# Altium schematic sheet MAIN_CONN.SchDoc
size A; SheetNumber: 5; SheetTotal: 30
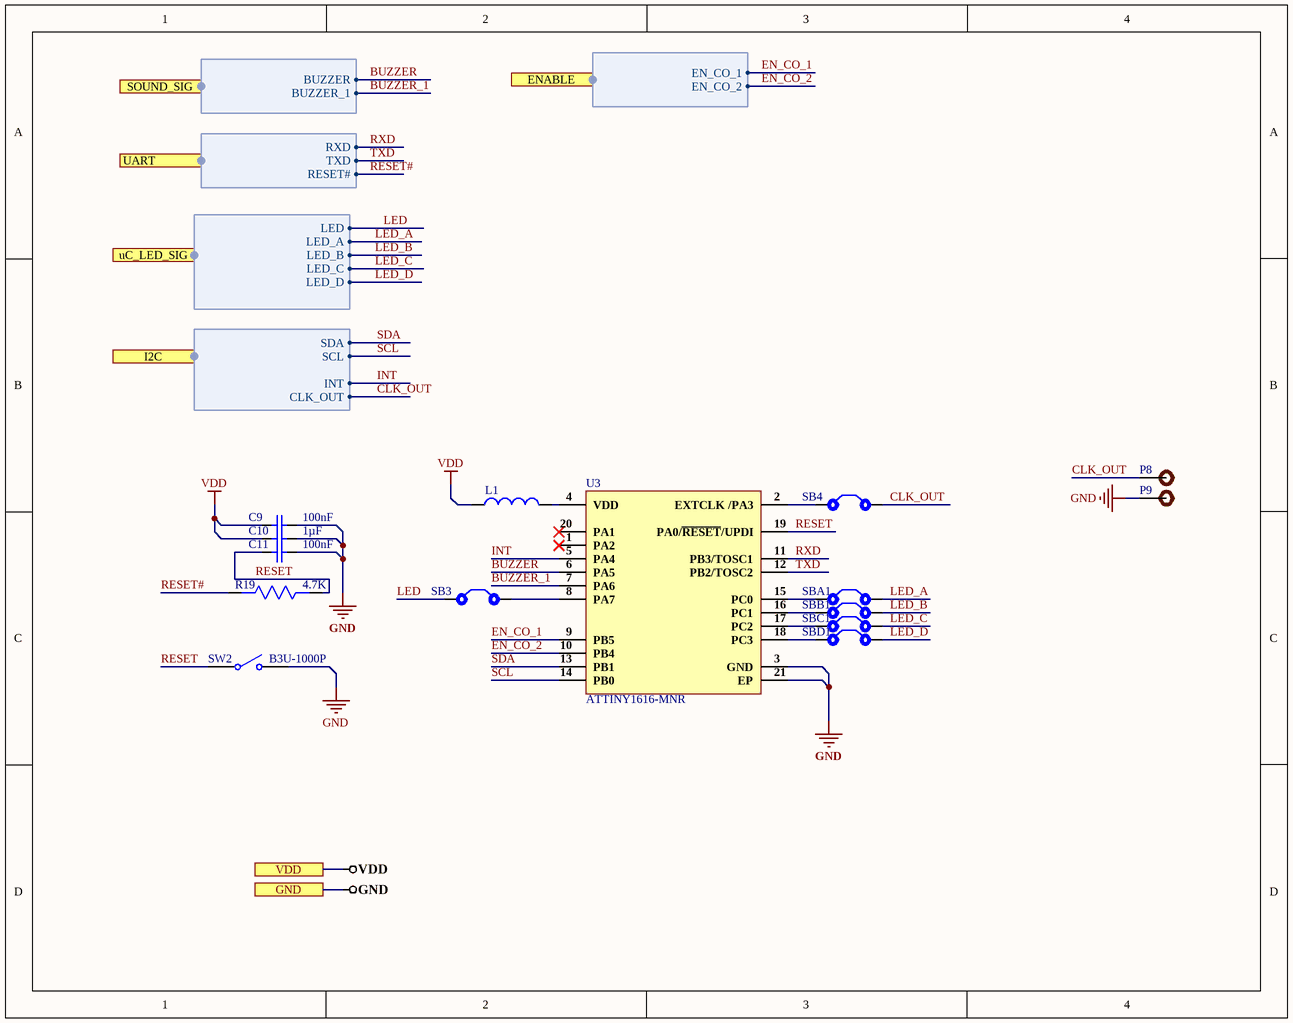
[diagram p0: MAIN_CONN.SchDoc]

## Parts
C9  100nF  [Cap0402]
C10  1µF  [Cap0402]
C11  100nF  [Cap0402]
L1  MMZ0603S601CT000  [IND 0201]  (value not drawn)
P8  Test Point  [TEST POINT]  (value not drawn)
P9  Test Point  [TEST POINT]  (value not drawn)
R19  4.7K  [Res-0201]
SB3  Solder Bridge  [Solder Bridge]  (value not drawn)
SB4  Solder Bridge  [Solder Bridge]  (value not drawn)
SBA1  Solder Bridge  [Solder Bridge]  (value not drawn)
SBB1  Solder Bridge  [Solder Bridge]  (value not drawn)
SBC1  Solder Bridge  [Solder Bridge]  (value not drawn)
SBD1  Solder Bridge  [Solder Bridge]  (value not drawn)
SW2  B3U-1000P  [B3U-1000P]
U3  ATTINY1616-MNR  [20-QFN]

## Ports
ENABLE (harness Harness_2), GND, I2C (harness Harness_3), SOUND_SIG (harness Harness_4), UART (harness Harness), uC_LED_SIG (harness Harness_1), VDD

## Harnesses
Harness: RXD, TXD, RESET#
Harness_1: LED_A, LED_B, LED_C, LED, LED_D
Harness_2: EN_CO_1, EN_CO_2
Harness_3: SDA, SCL, INT, CLK_OUT
Harness_4: BUZZER, BUZZER_1

## Nets
GND: C9.1 C10.1 C11.1 P9.1 SW2.2 U3.3(GND) U3.21(EP) ; port GND
VDD: C9.2 C10.2 L1.1 ; port VDD
BUZZER: U3.6(PA5) ; port SOUND_SIG.BUZZER
BUZZER_1: U3.7(PA6) ; port SOUND_SIG.BUZZER_1
CLK_OUT: P8.1 SB4.2 ; port I2C.CLK_OUT
EN_CO_1: U3.9(PB5) ; port ENABLE.EN_CO_1
EN_CO_2: U3.10(PB4) ; port ENABLE.EN_CO_2
INT: U3.5(PA4) ; port I2C.INT
LED: SB3.1 ; port uC_LED_SIG.LED
LED_A: SBA1.2 ; port uC_LED_SIG.LED_A
LED_B: SBB1.2 ; port uC_LED_SIG.LED_B
LED_C: SBC1.2 ; port uC_LED_SIG.LED_C
LED_D: SBD1.2 ; port uC_LED_SIG.LED_D
RESET: C11.2 R19.1 SW2.1 U3.19(PA0/~{RESET}/UPDI)
RESET#: R19.2 ; port UART.RESET#
RXD: U3.11(PB3/TOSC1) ; port UART.RXD
SCL: U3.14(PB0) ; port I2C.SCL
SDA: U3.13(PB1) ; port I2C.SDA
TXD: U3.12(PB2/TOSC2) ; port UART.TXD
NetL1_2: L1.2 U3.4(VDD)
NetSB3_2: SB3.2 U3.8(PA7)
NetSB4_1: SB4.1 U3.2(EXTCLK_/PA3)
NetSBA1_1: SBA1.1 U3.15(PC0)
NetSBB1_1: SBB1.1 U3.16(PC1)
NetSBC1_1: SBC1.1 U3.17(PC2)
NetSBD1_1: SBD1.1 U3.18(PC3)

Not connected (* = marked no-connect by the designer): U3 1(PA2)* 20(PA1)*

## Library data of the parts
C9 C11 = CC0402KRX7R8BB104: Cap Ceramic 0.1uF 25V X7R 10% SMD 0402 125C Paper T/R; Manufacturer: Yageo; Dissipation Factor: 3.5%; Supplier 1: Digi-Key; Manufacturer Part Number: CC0402KRX7R8BB104; RoHS: Yes; Category: Ceramic Capacitors; Stock 1: 1841009; Pricing 1: 1=0.10000, 10=0.03100, 50=0.01700, 100=0.01390, 500=0.00990, 1000=0.00777, 2500=0.00707, 5000=0.00650 (USD); Mount: Surface Mount; Case/Package: 0402; Case Code (Imperial): 0402; Case Code (Metric): 1005; Min Operating Temperature: -55°C; Max Operating Temperature: 125°C; Tolerance: 10%; Capacitance: 100nF; Dielectric: X7R; Voltage Rating: 25V; Voltage Rating (DC): 25V; Packaging: Tape and Reel; Termination: SMD/SMT; Resistor Type: Ceramic; Length: 1mm; Width: 0.02inch; Height: 0.5mm; Thickness: 0.022inch; Depth: 0.5mm; Radiation Hardening: No; Lead Free: Lead Free; Halogen Free: Halogen Free; ComponentLink1URL: https://datasheet.ciiva.com/11464/upy-gphc-x7r-6-3v-to-50v-8-11464889.pdf?src-supplier=Avnet; ComponentLink1Description: https://datasheet.ciiva.com/11464/upy-gphc-x7r-6-3v-to-50v-8-11464889.pdf?src-supplier=Avnet; ComponentLink2URL: https://datasheet.ciiva.com/13210/upy-gphc-x7r-6-3v-to-50v-8-12304-13210908.pdf?src-supplier=Mouser; ComponentLink2Description: https://datasheet.ciiva.com/13210/upy-gphc-x7r-6-3v-to-50v-8-12304-13210908.pdf?src-supplier=Mouser; ComponentLink3URL: https://datasheet.ciiva.com/17437/upy-gphc-x7r-6-3v-to-50v-8-17437357.pdf?src-supplier=Avnet+Europe; ComponentLink3Description: https://datasheet.ciiva.com/17437/upy-gphc-x7r-6-3v-to-50v-8-17437357.pdf?src-supplier=Avnet+Europe; Supplier Part Number 1: 311-2077-1-ND
C10 = GRM155R61E105KA12D: MURATA - GRM155R61E105KA12D - SMD Multilayer Ceramic Capacitor, 1 µF, 25 V, 0402 [1005 Metric], ± 10%, X5R, GRM Series; Capacitance: 1uF; Voltage Rating: 25V; Supplier 1: Digi-Key; Manufacturer: Murata; Manufacturer Part Number: GRM155R61E105KA12D; RoHS: Yes; Category: Ceramic Capacitors; Stock 1: 961231; Pricing 1: 1=0.11000, 10=0.08000, 50=0.04360, 100=0.03560, 500=0.02542, 1000=0.01997, 2500=0.01815, 5000=0.01670 (USD); Mount: Surface Mount; Case/Package: 0402; Case Code (Metric): 1005; Case Code (Imperial): 0402; Material: Ceramic; Weight: 0.000212oz; Min Operating Temperature: -55°C; Max Operating Temperature: 85°C; Tolerance: 10%; Packaging: Tape and Reel; Dielectric: X5R; Voltage: 25V; Termination: SMD/SMT; Voltage Rating (DC): 25V; Package Quantity: 10000; Series: GRM; Length: 1mm; Width: 0.5mm; Height: 0.5mm; Thickness: 0.022inch; Depth: 0.5mm; REACH SVHC: No SVHC; Lead Free: Lead Free; ComponentLink1URL: https://datasheet.ciiva.com/22732/1666664-22732122.pdf?src-supplier=Element14; ComponentLink1Description: https://datasheet.ciiva.com/22732/1666664-22732122.pdf?src-supplier=Element14; ComponentLink2URL: https://datasheet.ciiva.com/7719/1666664-7719006.pdf?src-supplier=Element14; ComponentLink2Description: https://datasheet.ciiva.com/7719/1666664-7719006.pdf?src-supplier=Element14; Supplier Part Number 1: 490-10017-1-ND
L1 = MMZ0603S601CT000: FERRITE BEAD 600 OHM 0201 1LN; Manufacturer: TDK; Impedance: 600R; Tolerance: 25%; DC Resistance (DCR): 1.45R; Max DC Current: 100mA; Supplier 1: Digi-Key; Manufacturer Part Number: MMZ0603S601CT000; RoHS: Yes; Category: Inductors; Stock 1: 1540; Pricing 1: 1=0.12000, 10=0.09900, 25=0.07680, 50=0.06380, 100=0.05500, 250=0.04400, 500=0.03960, 1000=0.03300, 5000=0.03080 (USD); Mount: Surface Mount; Case/Package: 0201; Core Material: Ferrite; Case Code (Metric): 0603; Case Code (Imperial): 0201; Packaging: Cut Tape; Package Quantity: 15000; Current Rating: 100mA; Length: 0.024inch; Width: 0.012inch; Height: 0.013inch; REACH SVHC: No SVHC; Lead Free: Lead Free; RoHS Compliant: Yes; ComponentLink1URL: https://datasheet.ciiva.com/46381/1795294-46381669.pdf?src-supplier=Element14; ComponentLink1Description: https://datasheet.ciiva.com/46381/1795294-46381669.pdf?src-supplier=Element14; ComponentLink2URL: https://datasheet.ciiva.com/46634/beads-commercial-signal-mmz-en-46634390.pdf?src-supplier=Digi-Key; ComponentLink2Description: https://datasheet.ciiva.com/46634/beads-commercial-signal-mmz-en-46634390.pdf?src-supplier=Digi-Key; ComponentLink3URL: https://datasheet.ciiva.com/48682/beads-commercial-signal-mmz-en-48682603.pdf?src-supplier=Avnet; ComponentLink3Description: https://datasheet.ciiva.com/48682/beads-commercial-signal-mmz-en-48682603.pdf?src-supplier=Avnet; ComponentLink4URL: https://datasheet.ciiva.com/46634/beads-commercial-signal-mmz-en-46634381.pdf?src-supplier=Digi-Key; ComponentLink4Description: https://datasheet.ciiva.com/46634/beads-commercial-signal-mmz-en-46634381.pdf?src-supplier=Digi-Key; Supplier Part Number 1: 445-2146-1-ND
P8 P9 = TEST POINT: Test Point ON
R19 = RMCF0201FT4K70: RES 4.7K OHM 1% 1/20W 0201; Manufacturer: Stackpole Electronics; Max Power Dissipation: 50mW; Temperature Coefficient: 200ppm/°C; Resistance: 4.7kR; Supplier 1: Digi-Key; Manufacturer Part Number: RMCF0201FT4K70; RoHS: Yes; Category: Chip SMD Resistors; Stock 1: 325790; Pricing 1: 1=0.10000, 10=0.02300, 100=0.00940, 1000=0.00424, 2500=0.00368, 5000=0.00304 (USD); Mount: Surface Mount; Case/Package: 0201; Case Code (Metric): 0603; Contact Plating: Tin,Matte; Case Code (Imperial): 0201; Min Operating Temperature: -55°C; Max Operating Temperature: 125°C; Packaging: Tape and Reel; Tolerance: 1%; Resistor Type: Thick Film; Number of Terminations: 2; Length: 0.024inch; Width: 0.012inch; Height: 0.009inch; Radiation Hardening: No; ComponentLink1URL: https://www.seielect.com/catalog/SEI-Packaging.pdf?src-supplier=Digi-Key; ComponentLink1Description: https://www.seielect.com/catalog/SEI-Packaging.pdf?src-supplier=Digi-Key; ComponentLink2URL: https://www.seielect.com/catalog/SEI-RMCF_RMCP.pdf?src-supplier=Avnet; ComponentLink2Description: https://www.seielect.com/catalog/SEI-RMCF_RMCP.pdf?src-supplier=Avnet; Supplier Part Number 1: RMCF0201FT4K70CT-ND
SB3 SB4 SBA1 SBB1 SBC1 SBD1 = Solder Bridge: Solder Bridge ON
SW2 = B3U-1000P: SWITCH TACTILE SPST-NO 0.05A 12V; Manufacturer: Omron; Mechanical Life: 200000Cycles; Operating Force: 1.5N; Throw Configuration: SPST; Current Rating: 50mA; Contact Resistance: 100mR; Illumination Type: Non-Illuminated,Illuminated; Switch Travel: 0.15mm; Switch Function: Off-Mom; Actuator Type: Standard; Actuator Length: 0.4mm; Ratings: Dust Proof,IP40; ComponentLink1URL: http://www.farnell.com/datasheets/60838.pdf?src-supplier=Farnell; ComponentLink1Description: http://www.farnell.com/datasheets/60838.pdf?src-supplier=Farnell; ComponentLink2URL: http://www.farnell.com/datasheets/60838.pdf?src-supplier=Element14; ComponentLink2Description: http://www.farnell.com/datasheets/60838.pdf?src-supplier=Element14; ComponentLink3URL: https://omronfs.omron.com/en_US/ecb/products/pdf/en-b3u.pdf?src-supplier=Digi-Key; ComponentLink3Description: https://omronfs.omron.com/en_US/ecb/products/pdf/en-b3u.pdf?src-supplier=Digi-Key; ComponentLink4URL: http://www.omron.com/ecb/products/pdf/en-b3u.pdf?src-supplier=Digi-Key; ComponentLink4Description: http://www.omron.com/ecb/products/pdf/en-b3u.pdf?src-supplier=Digi-Key; ComponentLink5URL: https://www.distrelec.biz/Web/Downloads/he/et/B3U_eng_datasheet.pdf?mime=application%2Fpdf&src-supplier=Distrelec; ComponentLink5Description: https://www.distrelec.biz/Web/Downloads/he/et/B3U_eng_datasheet.pdf?mime=application%2Fpdf&src-supplier=Distrelec; ComponentLink6URL: http://www.onlinecomponents.com/productFiles/mf-OM/en-b3u.pdf?src-supplier=Onlinecomponents.com; ComponentLink6Description: http://www.onlinecomponents.com/productFiles/mf-OM/en-b3u.pdf?src-supplier=Onlinecomponents.com; Supplier 1: Digi-Key; Manufacturer Part Number: B3U-1000P; Stock 1: 116454; Pricing 1: 1=1, 10=0.961, 25=0.9064, 50=0.7976, 100=0.7251, 250=0.68888, 500=0.67074, 1000=0.52571 (USD); Mount: Surface Mount; Weight: 0.000776oz; Contact Material: Silver; Min Operating Temperature: -25°C; Max Operating Temperature: 70°C; Packaging: Tape and Reel; Voltage Rating (DC): 12V; Package Quantity: 1; Max Current Rating: 50mA; Termination: SMD/SMT; Orientation: Straight; Max Voltage Rating (DC): 12V; Electrical Life: 200000Cycles; Insulation Resistance: 100MR; Contact Current Rating: 50mA; Length: 4mm; Height: 1.2mm; Depth: 2.5mm; Width: 3mm; REACH SVHC: Unknown; Lead Free: Lead Free; ComponentLink7URL: https://www.verical.com/server-webapp/html/getDatasheet?partID=552554&src-supplier=Verical; ComponentLink7Description: https://www.verical.com/server-webapp/html/getDatasheet?partID=552554&src-supplier=Verical; ComponentLink8URL: http://www.farnell.com/datasheets/1685550.pdf?src-supplier=Element14; ComponentLink8Description: http://www.farnell.com/datasheets/1685550.pdf?src-supplier=Element14; ComponentLink9URL: http://www.farnell.com/datasheets/2610940.pdf?src-supplier=Farnell; ComponentLink9Description: http://www.farnell.com/datasheets/2610940.pdf?src-supplier=Farnell; ComponentLink10URL: https://www.alliedelec.com/m/d/4c8a9ef82804fc3c241a13c1e298fd73.pdf?src-supplier=Allied+Electronics; ComponentLink10Description: https://www.alliedelec.com/m/d/4c8a9ef82804fc3c241a13c1e298fd73.pdf?src-supplier=Allied+Electronics; Supplier Part Number 1: SW1020DKR-ND
U3 = ATTINY1616-MNR: Microchip ATTINY1616-MNR, 8bit AVR Microcontroller, 20MHz, 16 kB Flash, 20-Pin VQFN; Interface: I2C,SPI,IrDA,UART,USART; Peripherals: Brown-out Detect/Reset,POR,PWM,WDT; Number of I/Os: 18; Memory Size: 16KB; Oscillator Type: Internal; Supplier 1: Digi-Key; Manufacturer: Microchip; Manufacturer Part Number: ATTINY1616-MNR; RoHS: No; Category: Microcontrollers; Stock 1: 3963; Pricing 1: 1=0.75000, 25=0.69000, 100=0.62000 (USD); Case/Package: VQFN; Min Operating Temperature: -40°C; Max Operating Temperature: 105°C; Memory Type: FLASH; Packaging: Cut Tape; Core Architecture: AVR; Frequency: 20MHz; ComponentLink1URL: http://www.microchip.com/mymicrochip/filehandler.aspx?ddocname=en606269&src-supplier=Digi-Key; ComponentLink1Description: http://www.microchip.com/mymicrochip/filehandler.aspx?ddocname=en606269&src-supplier=Digi-Key; Supplier Part Number 1: ATTINY1616-MNRCT-ND